# Altium schematic sheet Channel-A2.schdoc
size A4; SheetNumber: 1; SheetTotal: 5
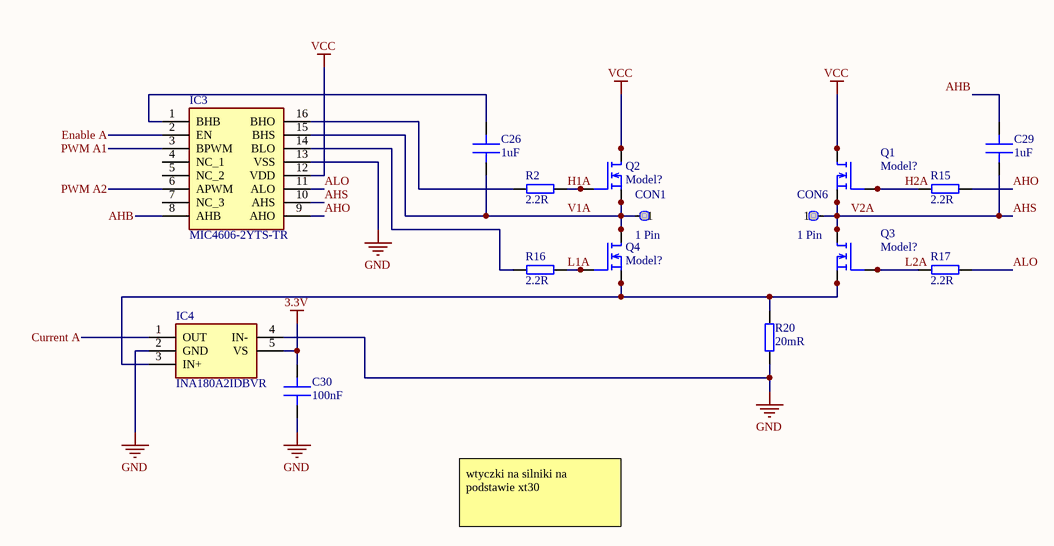
[diagram p0: Channel-A2.schdoc]

## Parts
C26  1uF  [C 0603]
C29  1uF  [C 0603]
C30  100nF  [C 0402]
CON1  1 Pin  [SMD PAD]
CON6  1 Pin  [SMD PAD]
IC3  MIC4606-2YTS-TR  [SOP65P640X120-16N]
IC4  INA180A2IDBVR  [SOT95P280X145-5N]
Q1  Model?  [DFN 3X3]
Q2  Model?  [DFN 3X3]
Q3  Model?  [DFN 3X3]
Q4  Model?  [DFN 3X3]
R2  2.2R  [R 0402]
R15  2.2R  [R 0402]
R16  2.2R  [R 0402]
R17  2.2R  [R 0402]
R20  20mR  [R 2512]

## Nets
3.3V: C30.1 IC4.5(VS)
GND: C30.2 IC3.13(VSS) IC4.2(GND) IC4.4(IN-) R20.1
VCC: IC3.12(VDD) Q1.5_8(D) Q2.5_8(D)
AHB: C29.1 IC3.8(AHB)
AHO: IC3.9(AHO) R15.1
AHS: C29.2 CON6.1 IC3.10(AHS) Q1.1,2,3(S) Q1.1,_2,_3(S) Q3.5_8(D)  [also labelled V2A]
ALO: IC3.11(ALO) R17.1
Current A: IC4.1(OUT)
Enable A: IC3.2(EN)
H1A: Q2.4(G) R2.2
H2A: Q1.4(G) R15.2
L1A: Q4.4(G) R16.2
L2A: Q3.4(G) R17.2
PWM A1: IC3.3(BPWM)
PWM A2: IC3.6(APWM)
V1A: C26.2 CON1.1 IC3.15(BHS) Q2.1,2,3(S) Q2.1,_2,_3(S) Q4.5_8(D)
NetC26_1: C26.1 IC3.1(BHB)
NetIC3_14: IC3.14(BLO) R16.1
NetIC3_16: IC3.16(BHO) R2.1
NetIC4_3: IC4.3(IN+) Q3.1,2,3(S) Q3.1,_2,_3(S) Q4.1,2,3(S) Q4.1,_2,_3(S) R20.2

Not connected (* = marked no-connect by the designer): IC3 4(NC_1) 5(NC_2) 7(NC_3)

## Notes on the sheet
- wtyczki na silniki na podstawie xt30

## Library data of the parts
C26 C29 C30 = Capacitor: MLCC Capacitor
IC3 = MIC4606-2YTS-TR: Integrated Circuit; Manufacturer_Name: Microchip; Datasheet Link: https://eu.mouser.com/datasheet/2/268/20005604B-1286645.pdf; Height: 1.2mm; Manufacturer_Part_Number: MIC4606-2YTS-TR; Mouser Part Number: 579-MIC4606-2YTS-TR; Mouser Price/Stock: https://www.mouser.co.uk/ProductDetail/Microchip-Technology/MIC4606-2YTS-TR?qs=fxR7EJxuiMGiGNq6G0IdXQ%3D%3D; Arrow Part Number: MIC4606-2YTS-TR; Arrow Price/Stock: https://www.arrow.com/en/products/mic4606-2yts-tr/microchip-technology?region=nac
IC4 = INA180A2IDBVR: Integrated Circuit; Manufacturer_Name: Texas Instruments; Datasheet Link: http://www.ti.com/lit/ds/symlink/ina180.pdf; Height: 1.45mm; Manufacturer_Part_Number: INA180A2IDBVR; Mouser Part Number: 595-INA180A2IDBVR; Mouser Price/Stock: https://www.mouser.co.uk/ProductDetail/Texas-Instruments/INA180A2IDBVR?qs=5aG0NVq1C4wYcJfa99BoHg%3D%3D; Arrow Part Number: INA180A2IDBVR; Arrow Price/Stock: https://www.arrow.com/en/products/ina180a2idbvr/texas-instruments?region=nac
Q1-Q4 = Power MOSFET: N-Mosfet DFN 5x6
R2 R15-R17 R20 = Resistor: General pourpouse resistor